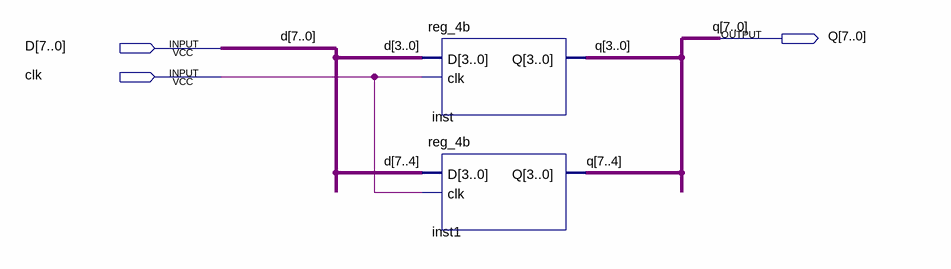
[diagram p0: schematic sheet]
// Quartus schematic reg_8b.bdf as structural Verilog: 2 symbols, 3 pins
module reg_8b (
  input  [7:0] D,
  input  clk,
  output [7:0] Q
);

  reg_4b inst (.D(D[3:0]), .clk(clk), .Q(Q[3:0]));
  reg_4b inst1 (.D(D[7:4]), .clk(clk), .Q(Q[7:4]));
endmodule
